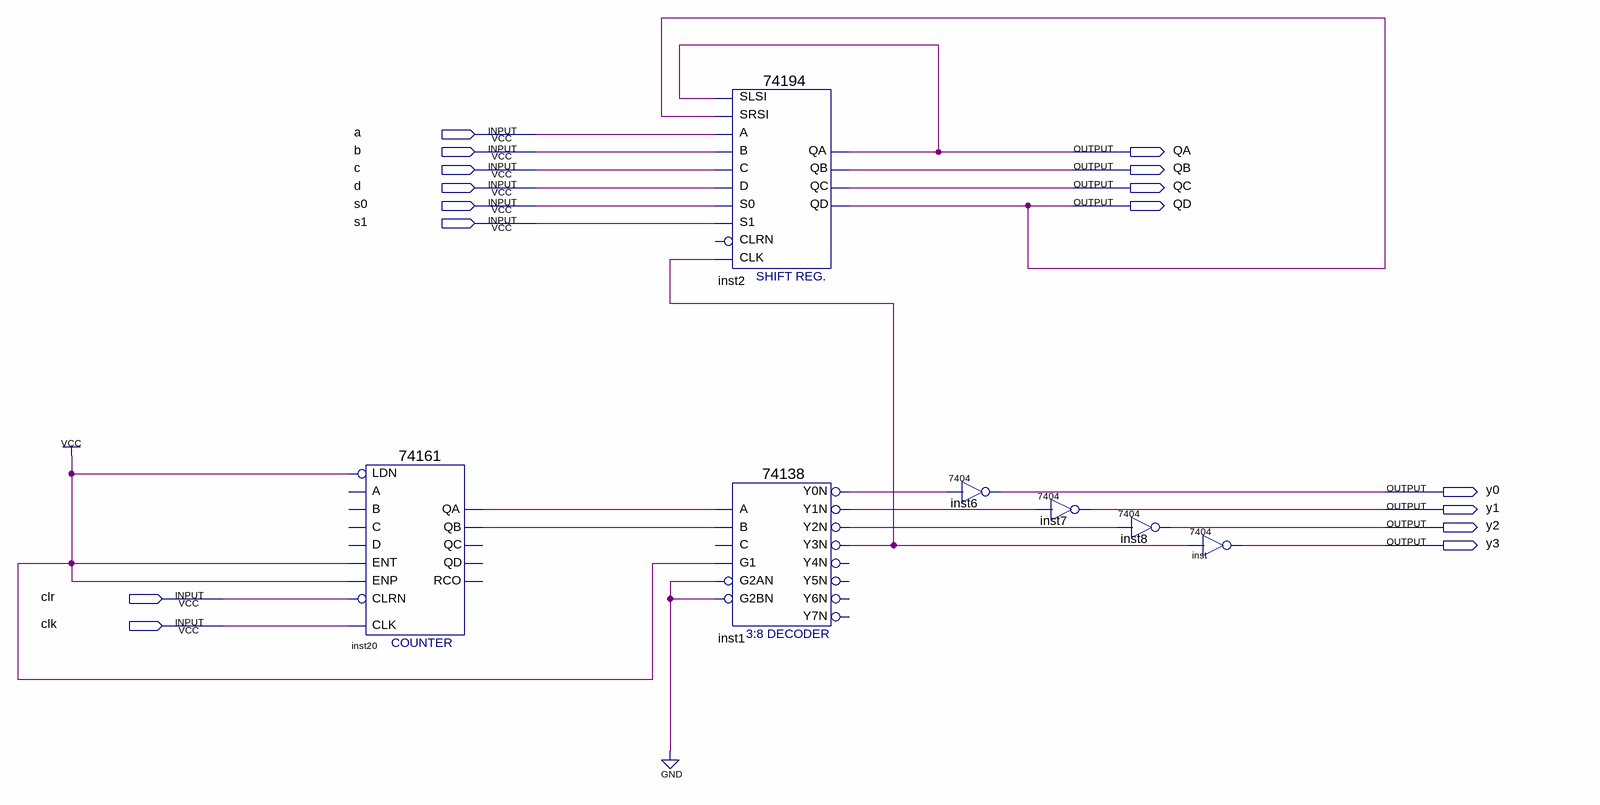
[diagram p0: schematic sheet]
// Quartus schematic 12.bdf as structural Verilog: 7 symbols, 16 pins
module \12  (
  input  a,
  input  b,
  input  c,
  input  d,
  input  s0,
  input  s1,
  input  clr,
  input  clk,
  output QA,
  output QB,
  output QC,
  output QD,
  output y0,
  output y1,
  output y2,
  output y3
);

  wire inst1_y0n, inst1_y1n, inst1_y2n, inst1_y3n, inst20_qa, inst20_qb;

  \74161  inst20 (
    .CLRN(clr), .CLK(clk), .ENP(1'b1), .LDN(1'b1), .ENT(1'b1), .QB(inst20_qb), .QA(inst20_qa));  // open: A, D, B, C, QD, QC, RCO
  \74194  inst2 (
    .SLSI(QA), .SRSI(QD), .B(b), .C(c), .CLK(inst1_y3n), .D(d), .S1(s1), .S0(s0), .A(a), .QA(QA), .QB(QB),
    .QC(QC), .QD(QD));  // open: CLRN
  \74138  inst1 (
    .A(inst20_qa), .B(inst20_qb), .G1(1'b1), .G2AN(1'b0), .G2BN(1'b0), .Y0N(inst1_y0n), .Y1N(inst1_y1n),
    .Y2N(inst1_y2n), .Y3N(inst1_y3n));  // open: C, Y4N, Y5N, Y6N, Y7N
  \7404  inst6 (.\2 (inst1_y0n), .\1 (y0));
  \7404  inst7 (.\2 (inst1_y1n), .\1 (y1));
  \7404  inst8 (.\2 (inst1_y2n), .\1 (y2));
  \7404  inst (.\2 (inst1_y3n), .\1 (y3));
endmodule
